# EasyEDA schematic Schematic.json
TITLE: Sheet_1; REV: 1.0; Date: 2026-08-18; Sheet: 1/1; Drawn By: sadritaneogi; Company: Hack Club
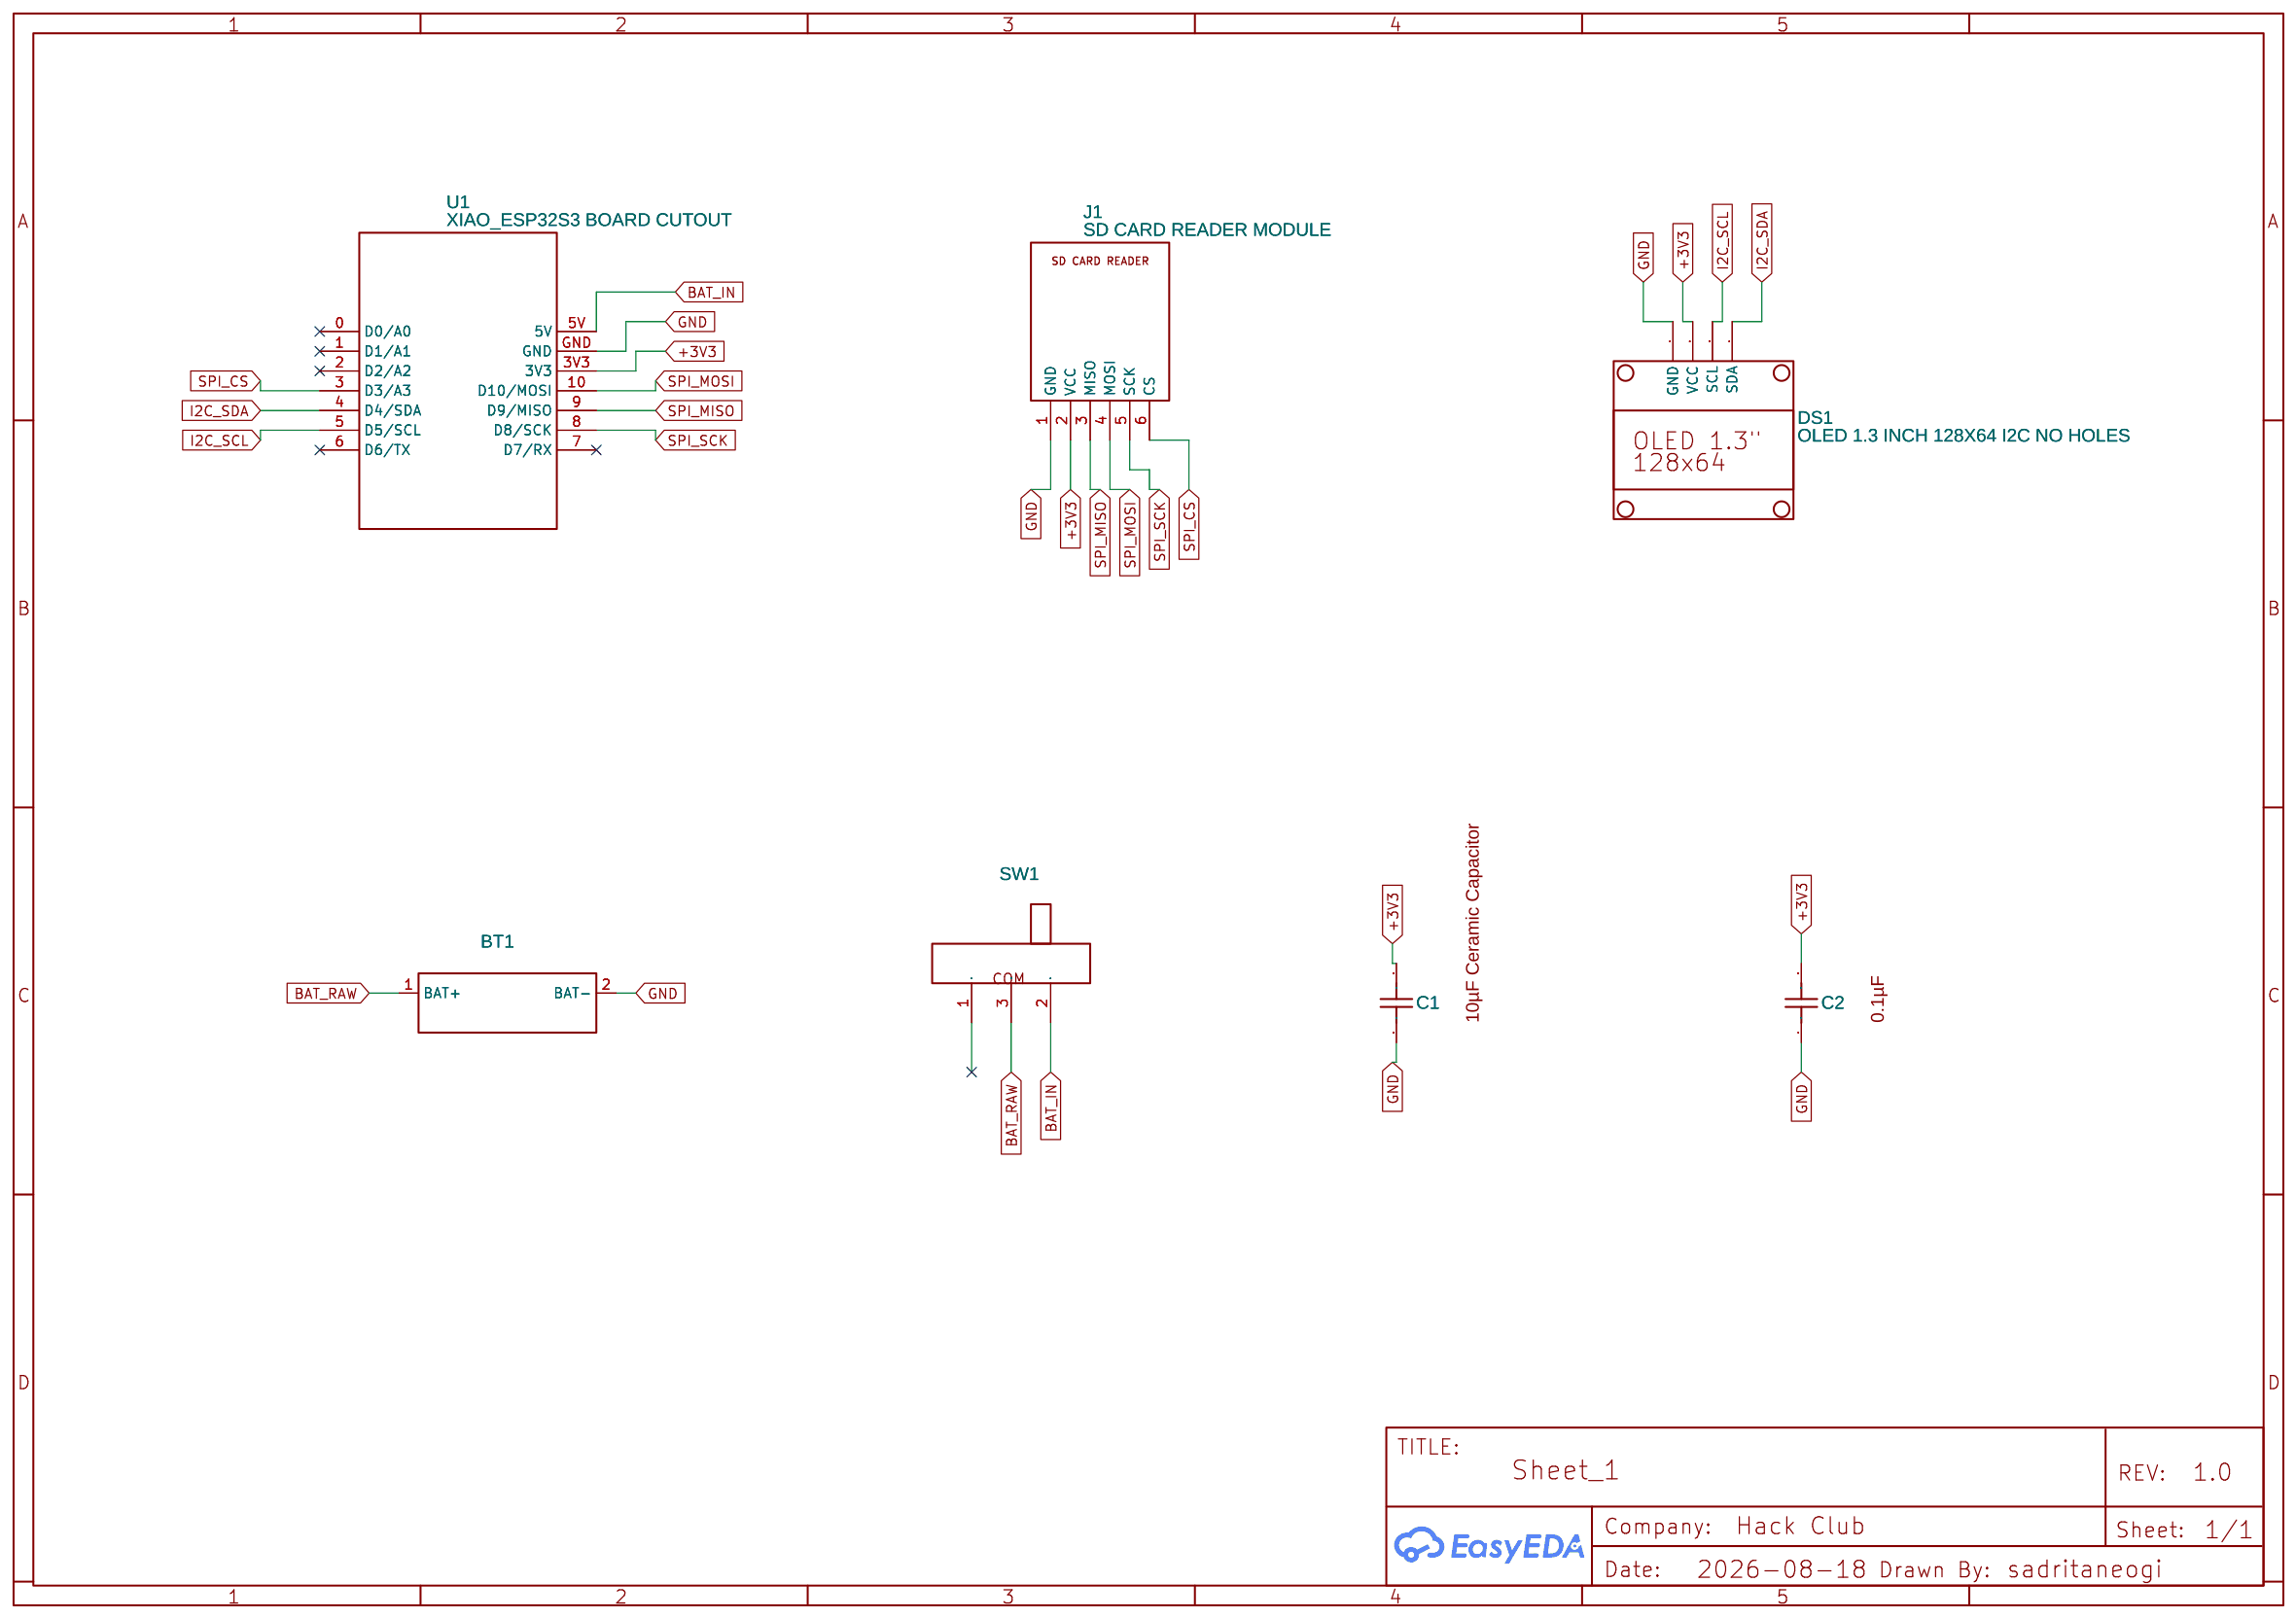
[diagram p0: schematic sheet]

## Parts
BT1  BATTERY_PROVISION  [HDR-TH_2P-P2.54-V-M-1]
C1  22pF Ceramic Capacitor  [GENCERAMICCAPACITOR]
C2  22pF Ceramic Capacitor  [GENCERAMICCAPACITOR]
DS1  OLED 1.3 INCH 128X64 I2C NO HOLES  [OLED 1.3 INCH 128X64 I2C]
J1  SD CARD READER MODULE  [MICRO-SD-CARD-READER-MODULE]
SW1  Mini Power Switch - SPDT  [MINI POWER SWITCH - SPDT]
U1  XIAO_ESP32S3 BOARD CUTOUT  [XIAO-ESP32S3-BOARD-OVAL-PADS]

## Library data of the parts
BT1 = B2B-PH-K-S: Manufacturer: Generic; Manufacturer Part: 2.54mm_1x2_Header; DNP: No; Contributor: finddigital
C1 C2 = 22pF Ceramic Capacitor: Contributor: kinoman0012
DS1 = OLED 1.3 INCH 128X64 I2C NO HOLES: Contributor: rifanoz
J1 = SD CARD READER MODULE: Contributor: dash.ektawork
SW1 = Mini Power Switch - SPDT: Manufacturer: E-Switch; Supplier: SparkFun; Supplier Part: COM-00102; Contributor: dthomp5
U1 = XIAO_ESP32S3 BOARD CUTOUT: Manufacturer: SeeedStudio; Manufacturer Part: XIAO ESP32C3; Supplier Part: 1597-113991054-ND; Supplier: Digi-Key; link: https://wiki.seeedstudio.com/XIAO_ESP32C3_Getting_Started/; Contributor: Carsen Klock; Package Display: No

## Nets
+3V3: C1.2 C2.2 DS1.2(VCC) J1.2(VCC) U1.3V3
GND: BT1.2(BAT-) C1.1 C2.1 DS1.1(GND) J1.1(GND) U1.GND
BAT_IN: SW1.2 U1.5V
BAT_RAW: BT1.1(BAT+) SW1.3(COM)
I2C_SCL: DS1.3(SCL) U1.5(D5/SCL)
I2C_SDA: DS1.4(SDA) U1.4(D4/SDA)
SPI_CS: J1.6(CS) U1.3(D3/A3)
SPI_MISO: J1.3(MISO) U1.9(D9/MISO)
SPI_MOSI: J1.4(MOSI) U1.10(D10/MOSI)
SPI_SCK: J1.5(SCK) U1.8(D8/SCK)

Not connected (* = marked no-connect by the designer): SW1 1; U1 0(D0/A0)* 1(D1/A1)* 2(D2/A2)* 6(D6/TX)* 7(D7/RX)*
